# EAGLE design Amplified-Mic-Electret (EAGLE 6.5.0)
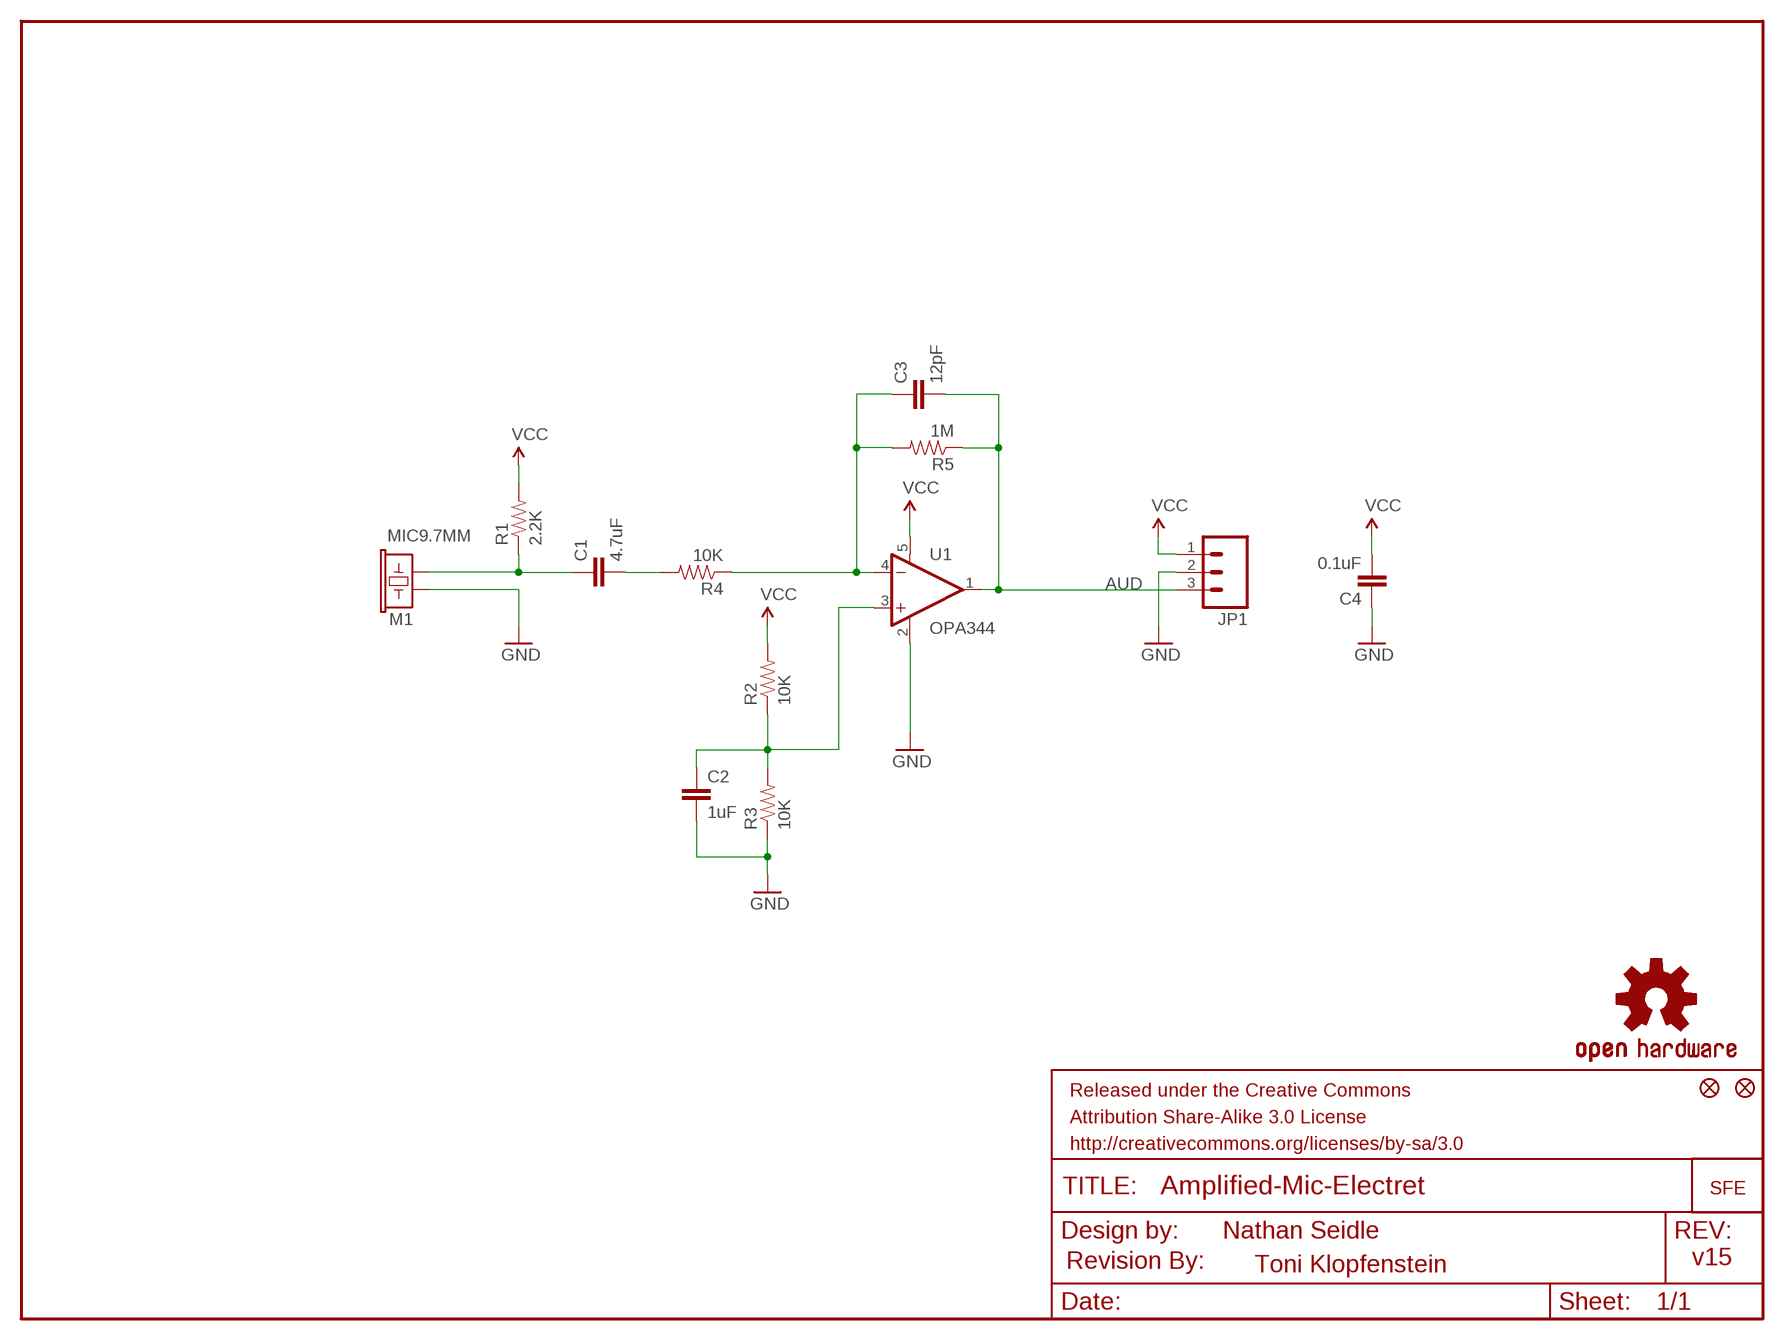
[diagram p0: schematic, sheet 1]

## Parts
C1  4.7uF  4.7UF-6.3V-10%(0603)0603  [0603-CAP]
C2  1uF  1.0UF-16V-10%(0603)  [0603-CAP]
C3  12pF  12PF-50V-5%(0603)  [0603-CAP]
C4  0.1uF  0.1UF-25V(+80/-20%)(0603)  [0603-CAP]
FRAME1  FRAME-LETTER  [CREATIVE_COMMONS]
JP1  M03PTH  [1X03]
JP2  FIDUCIAL1X2  [FIDUCIAL-1X2]
JP3  FIDUCIAL1X2  [FIDUCIAL-1X2]
LOGO1  OSHW-LOGOS  [OSHW-LOGO-S]
M1  MIC9.7MM  [MIC-9.7MM]
R1  2.2K  2.2KOHM1/10W1%(0603)  [0603-RES]
R2  10K  10KOHM1/10W1%(0603)0603  [0603-RES]
R3  10K  10KOHM1/10W1%(0603)0603  [0603-RES]
R4  10K  10KOHM1/10W1%(0603)0603  [0603-RES]
R5  1M  1MOHM1/10W1%(0603)  [0603-RES]
U1  OPA344  [SOT23-5]
U$1  LOGO-SFESK  [SFE-LOGO-FLAME]
U$2  REVISION  [REVISION]

## Nets
AUD: C3.2 JP1.3 R5.1 U1.1(OUT)
GND: C2.2 C4.1 JP1.2 M1.2 R3.1 U1.2(V-)
N$1: C1.1 M1.1 R1.1
N$2: C3.1 R4.1 R5.2 U1.4(-IN)
N$6: C1.2 R4.2
N$7: C2.1 R2.1 R3.2 U1.3(+IN)
VCC: C4.2 JP1.1 R1.2 R2.2 U1.5(V+)

## Notes on the sheet
- Nathan Seidle
- v15
- Toni Klopfenstein

## Library data of the parts
C1 = SparkFun-Capacitors:4.7UF-6.3V-10%(0603): CAP-08280; PROD_ID: CAP-08280
C2 = SparkFun-Capacitors:1.0UF-16V-10%(0603): CAP-00868; PROD_ID: CAP-00868; VALUE: 1.0uF
C3 = SparkFun-Capacitors:12PF-50V-5%(0603): CAP-09137; PROD_ID: CAP-09137
C4 = SparkFun-Capacitors:0.1UF-25V(+80/-20%)(0603): CAP-00810 Ceramic Standard decoupling cap; PROD_ID: CAP-00810
FRAME1 = SparkFun-Aesthetics:FRAME-LETTER: Schematic Frame Standard 8.5x11 US Letter frame
JP1 = SparkFun:M03: Header 3 Standard 3-pin 0.1" header. Use with straight break away headers (SKU : PRT-00116), right angle break away headers (PRT-00553), swiss pins (PRT-00743), machine pins (PRT-00117), and female headers (PRT-00115). Molex polarized connector foot print use with SKU : PRT-08232 with associated crimp pins and housings.
JP2 JP3 = SparkFun:FIDUCIAL: Fiducial Alignment Points Various fiducial points for machine vision alignment.
LOGO1 = SparkFun-Aesthetics:OSHW-LOGO: Open Source Hardware Logo This logo indicates the piece of hardware it is found on incorporates a OSHW license and/or adheres to the definition of open source hardware found here: http://freedomdefined.org/OSHW
M1 = SparkFun:MIC: Microphone Omni-directional electret microphone. 9.7mm standard diameter.
R1 = SparkFun-Resistors:2.2KOHM1/10W1%(0603): RES-08272; PROD_ID: RES-08272; VALUE: 2.2k
R2-R4 = SparkFun-Resistors:10KOHM1/10W1%(0603): RES-00824; PROD_ID: RES-00824
R5 = SparkFun-Resistors:1MOHM1/10W1%(0603): RES-07868; PROD_ID: RES-07868
U1 = SparkFun:OPA344
U$1 = SparkFun:LOGO-SFE: Spark Fun Electronics PCB Logo This is the standard Spark Fun Electronics PCB logo.
U$2 = SparkFun-Aesthetics:REVISION

## Board
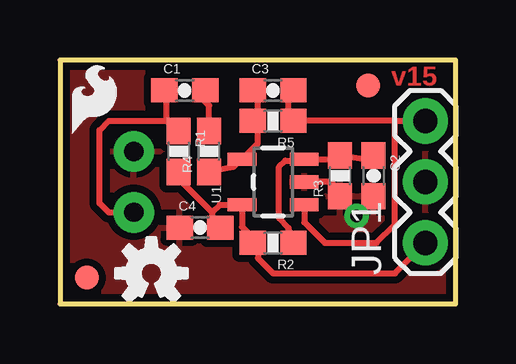
[diagram p1: board, top side]
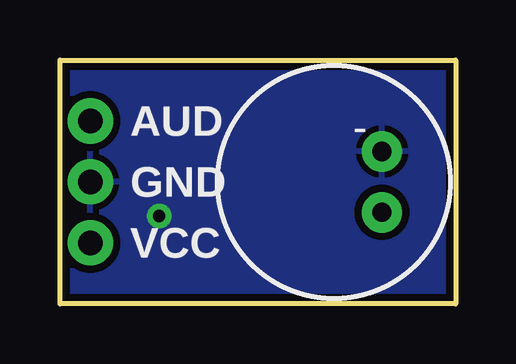
[diagram p2: board, bottom side, seen from below]

Size 16.51 x 10.16 mm. Coordinates in mm from the lower left corner, seen from the top.
Outline: 0,0 16.51,0 16.51,10.16 0,10.16 0,0
Copper layers (1*16): Top 0.035mm / dielectric 1.5mm / Bottom 0.035mm
Design rules "SparkFun *": minimum track width 8mil, minimum drill 20mil, track to track 8mil, track to pad 8mil, pad to pad 8mil, via to via 8mil, smd to smd 8mil, copper to edge 9mil, drill to drill 8mil, minimum pad ring 12mil, minimum via ring 10mil, stop-mask expansion 4mil, vias tented up to drill 20mil, thermal gap 10mil

### Footprints (pad centres in the part's own frame; a part is rotated, then mirrored left to right if it is on the bottom)
0603-CAP = smd 1.1 x 1: 1 -0.85,0; 2 0.85,0
1X03 = drill 1.016 pad 1.88: 1 0,0; 2 2.54,0; 3 5.08,0
FIDUCIAL-1X2 = smd 1 x 1: 1 0,0
MIC-9.7MM = drill 0.8 pad 1.676: 1 -2,1.27; 2 -2,-1.27
0603-RES = smd 1.1 x 1: 1 -0.85,0; 2 0.85,0
SOT23-5 = smd 0.55 x 1.2: 1 -0.95,-1.3; 2 0,-1.3; 3 0.95,-1.3; 4 0.95,1.3; 5 -0.95,1.3

### Placement (x,y rotation side)
C1  5.21,8.89 0 top
C2  13.08,5.33 270 top
C3  8.89,8.89 0 top
C4  5.84,3.17 0 top
FRAME1  -11.71,-8.89 0 top  (outside the outline)
JP1  15.24,2.54 90 top
JP2  12.85,9.09 0 top
JP3  1.12,1.09 0 top
LOGO1  3.81,1.27 0 top
M1  5.08,5.08 180 bottom
R1  4.95,6.35 270 top
R2  8.89,2.54 180 top
R3  11.68,5.33 90 top
R4  6.22,6.35 90 top
R5  8.89,7.62 180 top
U1  8.89,5.08 90 top
U$1  0.51,7.11 0 top
U$2  0,-11.43 0 top  (outside the outline)

### Tracks (layer width: path | path; a pad name or v marks a point on that pad's centre or on a via)
AUD
  Top 0.254: 9.53,7.61 9.53,7.49 | 9.53,7.61 R5.1 13.97,7.62 | C3.2 9.53,8.88 9.53,7.61 | 13.97,7.62 JP1.3 | U1.1 10.19,3.4 11.05,2.54 13.21,2.54 13.97,3.3 13.97,7.62
GND  (via drill 0.51)
  Top 0.254: 10.16,5.08 U1.2 11.3,5.08 11.68,4.7 R3.1
  other vias: 12.37,3.66
  pour Bottom (isolate 0.305): 0,0 0,10.16 16.51,10.16 16.51,0
  pour Top (isolate 0.305): 0,0 0,10.16 16.51,10.16 16.51,0
N$1
  Top 0.254: R1.1 5.08,6.99 | M1.1 2.03,3.81 1.65,4.19 1.65,7.24 2.03,7.62 4.45,7.62 | C1.1 4.45,8.89 4.45,7.62 | R1.1 4.95,6.99 | R1.1 4.95,7.11 4.45,7.62
N$2
  Top 0.254: C3.1 8.26,8.88 8.26,7.63 R5.2 8.26,7.62 8.26,6.7 U1.4 7.55,6.03 7.22,5.7 R4.1
N$6
  Top 0.254: C1.2 5.73,8.78 5.71,8.76 6.22,8.26 R4.2
N$7
  Top 0.254: 10.16,5.97 10.16,6 U1.3 | C2.1 13.08,5.97 13.07,5.98 R3.2 11.68,5.97 11.62,6.03 U1.3 | R2.1 9.54,3.16 9.14,3.56 9.14,5.71 9.4,5.97 10.16,5.97 | 10.16,5.97 10.19,6 U1.3
VCC
  Top 0.254: JP1.1 13.97,1.27 8.89,1.27 8.26,1.91 8.26,2.54 | R1.2 5.21,5.57 | R1.2 5.08,5.71 | 8.26,2.54 R2.2 | 8.26,2.54 7.59,3.21 U1.5 6.67,4.13 6.35,3.81 | R1.2 4.95,5.21 6.35,3.81 | 6.35,3.81 6.35,3.52 C4.2

### Text on the board
Top: v15
bPlace: AUD | GND | VCC
tValues: DNP | Mic on opposite side | Mic Breakout
tDocu: Nathan Seidle | Toni Klopfenstein